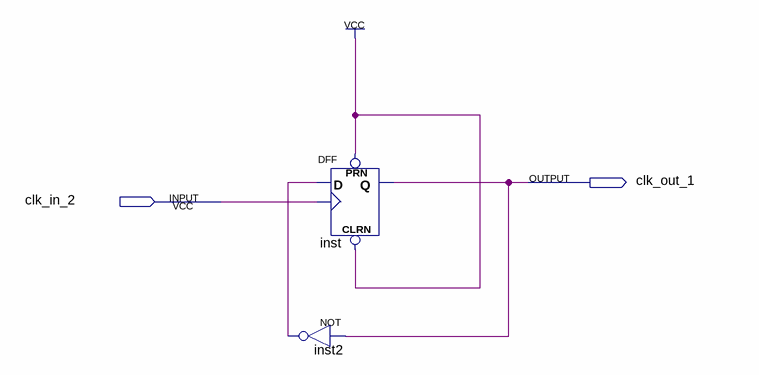
[diagram p0: schematic sheet]
// Quartus schematic cnt2.bdf as structural Verilog: 2 symbols, 2 pins
module cnt2 (
  input  clk_in_2,
  output clk_out_1
);

  wire inst2_out;

  DFF inst (.CLRN(1'b1), .CLK(clk_in_2), .D(inst2_out), .PRN(1'b1), .Q(clk_out_1));
  not inst2 (inst2_out, clk_out_1);
endmodule
